# EAGLE board FI-pi Milanpreet Singh (EAGLE 8.2.1)
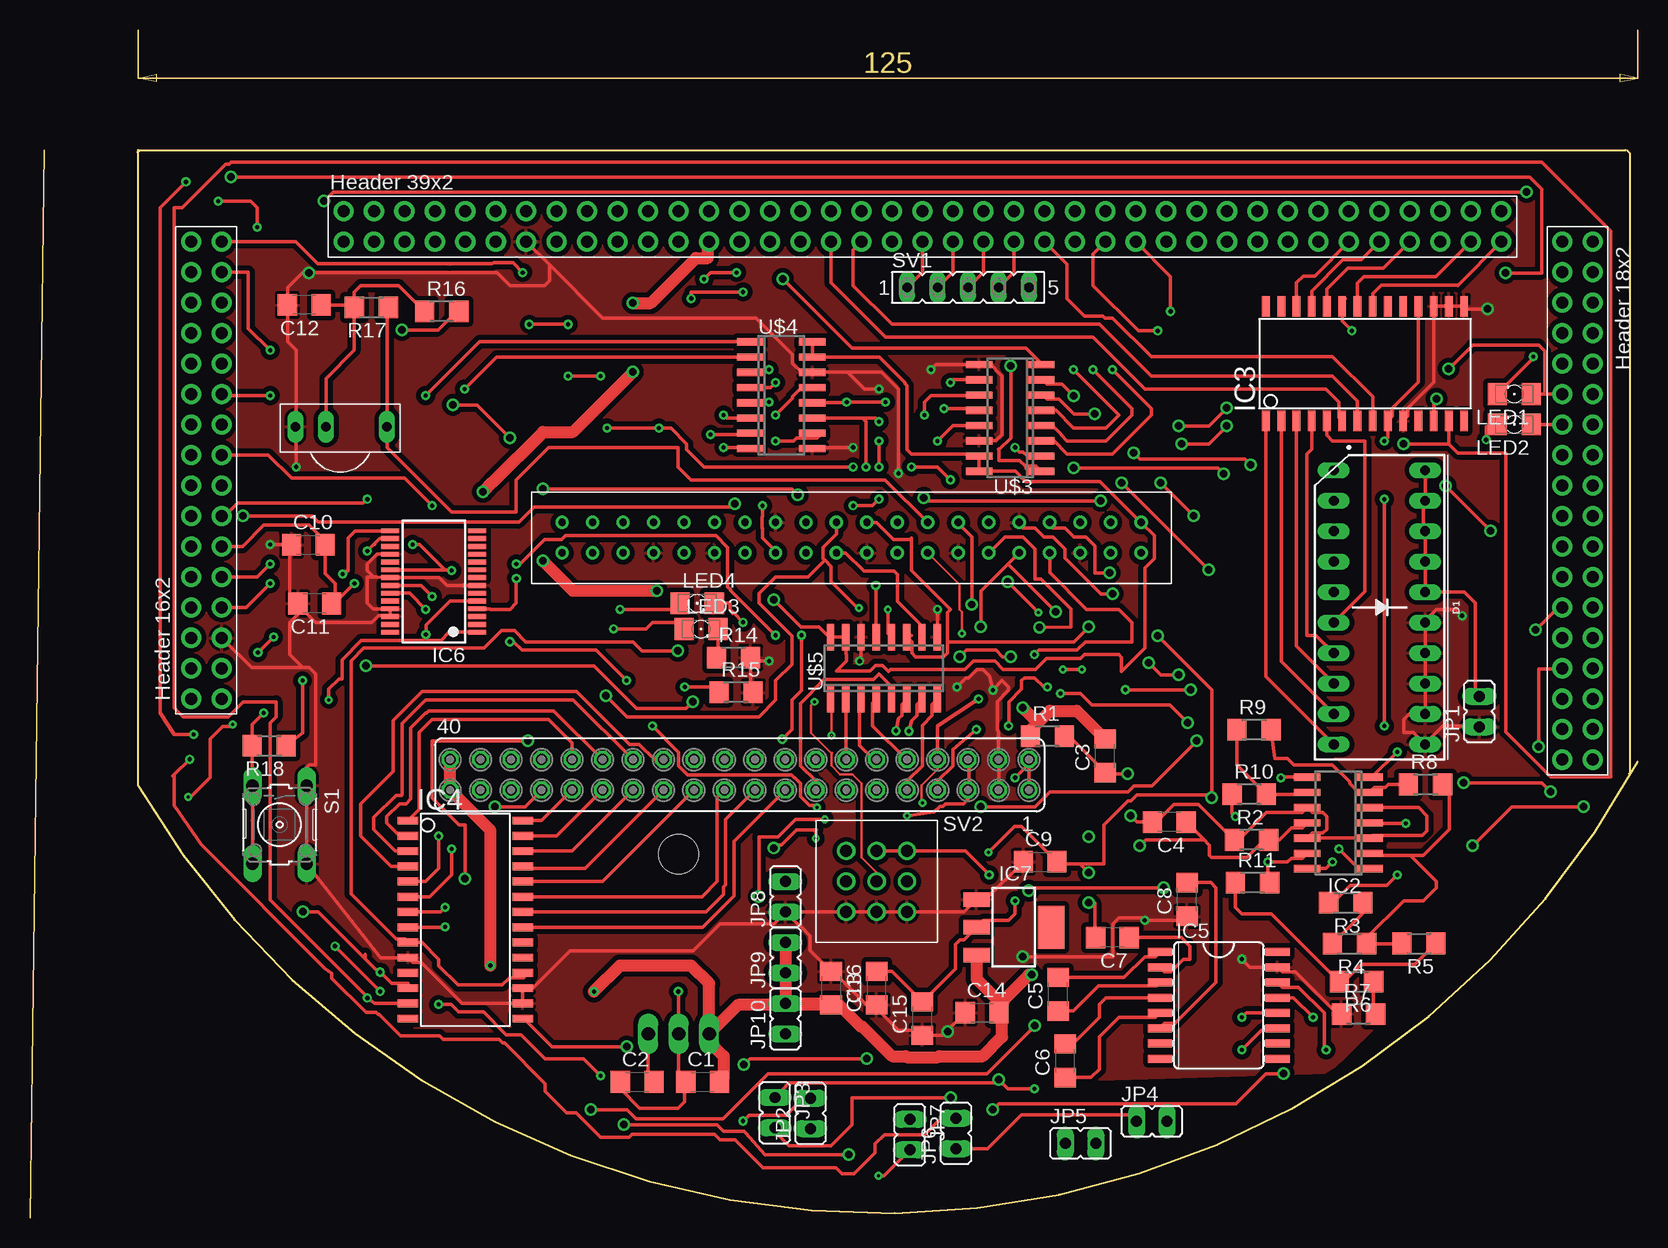
[diagram p2: board, top side]
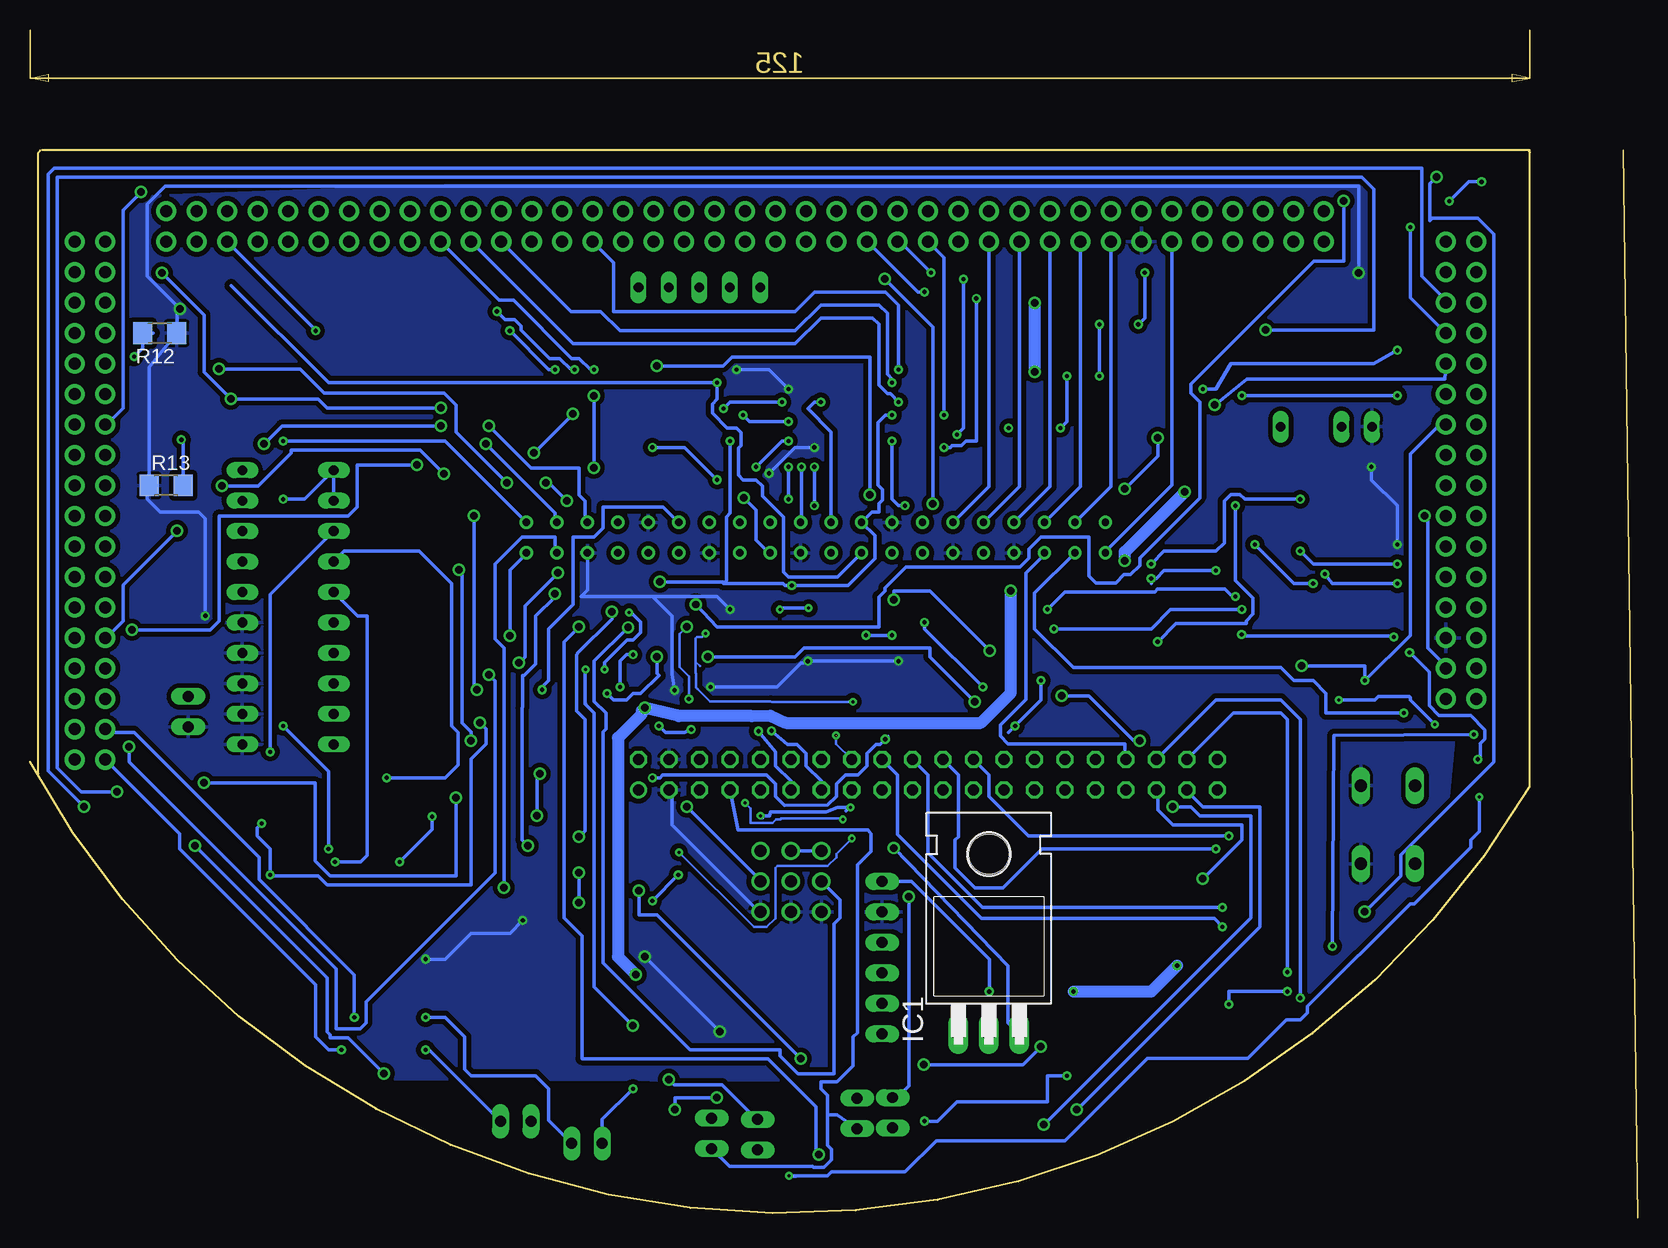
[diagram p3: board, bottom side, seen from below]

Size 125.05 x 88.63 mm. Coordinates in mm from the lower left corner, seen from the top.
Outline: 0,88.43 0.15,88.58
Outline: 124.2,88.58 124.4,88.38 124.4,36.68 124.35,36.63
Outline: 124.05,88.63 0.05,88.63 0.05,35.63 arc122 125.05,37.63
Copper layers (1*16): Top 0.035mm / dielectric 1.5mm / Bottom 0.035mm
Design rules "default": minimum track width 10mil, minimum drill 24mil, track to track 8mil, track to pad 8mil, pad to pad 8mil, via to via 8mil, smd to smd 8mil, copper to edge 40mil, drill to drill 8mil, minimum pad ring 10mil, minimum via ring 8mil, stop-mask expansion 4mil, vias tented up to drill 0mil, thermal gap 10mil
Net classes: 0 default: width 0.3 mm, clearance 0.4 mm; 1 MB29: width 1 mm, clearance 0.5 mm

## Footprints (pad centres in the part's own frame; a part is rotated, then mirrored left to right if it is on the bottom)
C1206 = smd 1.6 x 1.8: 1 -1.4,0; 2 1.4,0
LED_BARGRAPH_10 = drill 0.813 long: 1 -11.43,-3.81; 2 -8.89,-3.81; 3 -6.35,-3.81; 4 -3.81,-3.81; 5 -1.27,-3.81; 6 1.27,-3.81; 7 3.81,-3.81; 8 6.35,-3.81; 9 8.89,-3.81; 10 11.43,-3.81; 11 11.43,3.81; 12 8.89,3.81; 13 6.35,3.81; 14 3.81,3.81; 15 1.27,3.81; 16 -1.27,3.81; 17 -3.81,3.81; 18 -6.35,3.81; 19 -8.89,3.81; 20 -11.43,3.81
TO220H = drill 1.118 long: 1 -2.54,-10.16; 2 0,-10.16; 3 2.54,-10.16 | hole 3.302: 0,4.826
SO14 = smd 0.6 x 2.2: 1 -3.81,-2.6; 2 -2.54,-2.6; 3 -1.27,-2.6; 4 0,-2.6; 5 1.27,-2.6; 6 2.54,-2.6; 7 3.81,-2.6; 8 3.81,2.6; 9 2.54,2.6; 10 1.27,2.6; 11 0,2.6; 12 -1.27,2.6; 13 -2.54,2.6; 14 -3.81,2.6
SO28W = smd 0.65 x 1.7: 1 -7.62,-4.78; 2 -6.35,-4.78; 3 -5.08,-4.78; 4 -3.81,-4.78; 5 -2.54,-4.78; 6 -1.27,-4.78; 7 0,-4.78; 8 1.27,-4.78; 9 2.54,-4.78; 10 3.81,-4.78; 11 5.08,-4.78; 12 6.35,-4.78; 13 7.62,-4.78; 14 8.89,-4.78; 15 8.89,4.78; 16 7.62,4.78; 17 6.35,4.78; 18 5.08,4.78; 19 3.81,4.78; 20 2.54,4.78; 21 1.27,4.78; 22 0,4.78; 23 -1.27,4.78; 24 -2.54,4.78; 25 -3.81,4.78; 26 -5.08,4.78; 27 -6.35,4.78; 28 -7.62,4.78
SO16L = smd 0.66 x 2.032: 1 -4.445,-4.902; 2 -3.175,-4.902; 3 -1.905,-4.902; 4 -0.635,-4.902; 5 0.635,-4.902; 6 1.905,-4.902; 7 3.175,-4.902; 8 4.445,-4.902; 9 4.445,4.902; 10 3.175,4.902; 11 1.905,4.902; 12 0.635,4.902; 13 -0.635,4.902; 14 -1.905,4.902; 15 -3.175,4.902; 16 -4.445,4.902
SSOP28 = smd 0.4 x 1.5: 1 -4.225,-3.625; 2 -3.575,-3.625; 3 -2.925,-3.625; 4 -2.275,-3.625; 5 -1.625,-3.625; 6 -0.975,-3.625; 7 -0.325,-3.625; 8 0.325,-3.625; 9 0.975,-3.625; 10 1.625,-3.625; 11 2.275,-3.625; 12 2.925,-3.625; 13 3.575,-3.625; 14 4.225,-3.625; 15 4.225,3.625; 16 3.575,3.625; 17 2.925,3.625; 18 2.275,3.625; 19 1.625,3.625; 20 0.975,3.625; 21 0.325,3.625; 22 -0.325,3.625; 23 -0.975,3.625; 24 -1.625,3.625; 25 -2.275,3.625; 26 -2.925,3.625; 27 -3.575,3.625; 28 -4.225,3.625
SOT223 = smd 1.219 x 2.235: 1 -2.311,-3.099; 2 0,-3.099; 3 2.311,-3.099 | smd 3.6 x 2.2: TAB 0,3.099
JP1 = drill 0.914 long: 1 0,-1.27; 2 0,1.27
LED_1206 = smd 1.6 x 1.803: A -1.422,0; C 1.422,0
R1206 = smd 1.6 x 1.803: 1 -1.422,0; 2 1.422,0
B3F-10XX = drill 1.016 long: 1 -3.251,2.261; 2 3.251,2.261; 3 -3.251,-2.261; 4 3.251,-2.261
FE05-1 = drill 0.813 long: 1 -5.08,0; 2 -2.54,0; 3 0,0; 4 2.54,0; 5 5.08,0
FE20-2 = drill 0.914: 1 -24.13,1.27 | drill 0.914 octagon: 2 -24.13,-1.27; 3 -21.59,1.27; 4 -21.59,-1.27; 5 -19.05,1.27; 6 -19.05,-1.27; 7 -16.51,1.27; 8 -16.51,-1.27; 9 -13.97,1.27; 10 -13.97,-1.27; 11 -11.43,1.27; 12 -11.43,-1.27; 13 -8.89,1.27; 14 -8.89,-1.27; 15 -6.35,1.27; 16 -6.35,-1.27; 17 -3.81,1.27; 18 -3.81,-1.27; 19 -1.27,1.27; 20 -1.27,-1.27; 21 1.27,1.27; 22 1.27,-1.27; 23 3.81,1.27; 24 3.81,-1.27; 25 6.35,1.27; 26 6.35,-1.27; 27 8.89,1.27; 28 8.89,-1.27; 29 11.43,1.27; 30 11.43,-1.27; 31 13.97,1.27; 32 13.97,-1.27; 33 16.51,1.27; 34 16.51,-1.27; 35 19.05,1.27; 36 19.05,-1.27; 37 21.59,1.27; 38 21.59,-1.27; 39 24.13,1.27; 40 24.13,-1.27
DAUGHTERBOARD = drill 1 pad 1.676: 1 -22.86,-22.86; 1' -25.4,-22.86; 2 -22.86,-20.32; 2' -25.4,-20.32; 3 -22.86,-17.78; 3' -25.4,-17.78; 4 -22.86,-15.24; 4' -25.4,-15.24; 5 -22.86,-12.7; 5' -25.4,-12.7; 6 -22.86,-10.16; 6' -25.4,-10.16; 7 -22.86,-7.62; 7A -25.4,-7.62; 8 -22.86,-5.08; 8A -25.4,-5.08; 9 -22.86,-2.54; 9A -25.4,-2.54; 10 -22.86,0; 10A -25.4,0; 11 -22.86,2.54; 11' -25.4,2.54; 12 -22.86,5.08; 12' -25.4,5.08; 13 -22.86,7.62; 13' -25.4,7.62; 14 -22.86,10.16; 14' -25.4,10.16; 15 -22.86,12.7; 15' -25.4,12.7; 16 -22.86,15.24; 16' -25.4,15.24; 17A -12.7,17.78; 17B -12.7,15.24; 18 -10.16,15.24; 18' -10.16,17.78; 19 -7.62,15.24; 19' -7.62,17.78; 20 -5.08,15.24; 20A -5.08,17.78; 21 -2.54,15.24; 21A -2.54,17.78; 22 0,15.24; 22' 0,17.78; 23 2.54,15.24; 23' 2.54,17.78; 24 5.08,15.24; 24' 5.08,17.78; 25 7.62,15.24; 25' 7.62,17.78; 26 10.16,15.24; 26' 10.16,17.78; 27 12.7,15.24; 27' 12.7,17.78; 28 15.24,15.24; 28' 15.24,17.78; 29 17.78,15.24; 29' 17.78,17.78; 30 20.32,15.24; 30' 20.32,17.78; 31 22.86,15.24; 31' 22.86,17.78; 32 25.4,15.24; 32' 25.4,17.78; 33 27.94,15.24; 33' 27.94,17.78; 34 30.48,15.24; 34' 30.48,17.78; 35 33.02,15.24; 35A 33.02,17.78; 36 35.56,15.24; 36' 35.56,17.78; 37 38.1,15.24; 37' 38.1,17.78; 38 40.64,15.24; 38' 40.64,17.78; 39 43.18,15.24; 39' 43.18,17.78; 40 45.72,15.24; 40' 45.72,17.78; 41 48.26,15.24; 41' 48.26,17.78; 42 50.8,15.24; 42' 50.8,17.78; 43 53.34,15.24; 43' 53.34,17.78; 44 55.88,15.24; 44' 55.88,17.78; 45 58.42,15.24; 45' 58.42,17.78; 46 60.96,15.24; 46' 60.96,17.78; 47 63.5,15.24; 47' 63.5,17.78; 48 66.04,15.24; 48' 66.04,17.78; 49 68.58,15.24; 49' 68.58,17.78; 50 71.12,15.24; 50' 71.12,17.78; 51 73.66,15.24; 51' 73.66,17.78; 52 76.2,15.24; 52' 76.2,17.78; 53 78.74,15.24; 53' 78.74,17.78; 54 81.28,15.24; 54' 81.28,17.78; 55 83.82,15.24; 55' 83.82,17.78; 57 88.9,15.24; 57A 91.44,15.24; 58 88.9,12.7; 58A 91.44,12.7; 59 88.9,10.16; 59A 91.44,10.16; 60 88.9,7.62; 60A 91.44,7.62; 61 88.9,5.08; 61' 91.44,5.08; 62 88.9,2.54; 62' 91.44,2.54; 63 88.9,0; 63' 91.44,0; 64 88.9,-2.54; 64' 91.44,-2.54; 65 88.9,-5.08; 65' 91.44,-5.08; 66 88.9,-7.62; 66' 91.44,-7.62; 67 88.9,-10.16; 67' 91.44,-10.16; 68 88.9,-12.7; 68' 91.44,-12.7; 69 88.9,-15.24; 69' 91.44,-15.24; 70 88.9,-17.78; 70' 91.44,-17.78; 71 88.9,-20.32; 71' 91.44,-20.32; 72 88.9,-22.86; 72' 91.44,-22.86; 73 88.9,-25.4; 73' 91.44,-25.4; 74 88.9,-27.94; 74' 91.44,-27.94
MALE_HEADER_PACKAGE = drill 0.6: 1 -35.56,12.7; 2 -35.56,15.24; 3 -33.02,12.7; 4 -33.02,15.24; 5 -30.48,12.7; 6 -30.48,15.24; 7 -27.94,12.7; 8 -27.94,15.24; 9 -25.4,12.7; 10 -25.4,15.24; 11 -22.86,12.7; 12 -22.86,15.24; 13 -20.32,12.7; 14 -20.32,15.24; 15 -17.78,12.7; 16 -17.78,15.24; 17 -15.24,12.7; 18 -15.24,15.24; 19 -12.7,12.7; 20 -12.7,15.24; 21 -10.16,12.7; 22 -10.16,15.24; 23 -7.62,12.7; 24 -7.62,15.24; 25 -5.08,12.7; 26 -5.08,15.24; 27 -2.54,12.7; 28 -2.54,15.24; 29 0,12.7; 30 0,15.24; 31 2.54,12.7; 32 2.54,15.24; 33 5.08,12.7; 34 5.08,15.24; 35 7.62,12.7; 36 7.62,15.24; 37 10.16,12.7; 38 10.16,15.24; 39 12.7,12.7; 40 12.7,15.24
SO16 = smd 0.6 x 2.2: 1 -4.445,-2.6; 2 -3.175,-2.6; 3 -1.905,-2.6; 4 -0.635,-2.6; 5 0.635,-2.6; 6 1.905,-2.6; 7 3.175,-2.6; 8 4.445,-2.6; 9 4.445,2.6; 10 3.175,2.6; 11 1.905,2.6; 12 0.635,2.6; 13 -0.635,2.6; 14 -1.905,2.6; 15 -3.175,2.6; 16 -4.445,2.6
TSOP17XX = drill 0.813 long: GND -3.81,0; OUT 3.81,0; V+ -1.27,0
SERVO = drill 1: 1 -20.32,5.08; 1" -15.24,5.08; 1' -17.78,5.08; 2 -20.32,2.54; 2" -15.24,2.54; 2' -17.78,2.54; 3 -20.32,0; 3" -15.24,0; 3' -17.78,0

## Placement (x,y rotation side)
C1  100uf  [C1206]  47.12,10.94 0 top
C2  10uf  [C1206]  41.66,10.94 0 top
C3  .1uf  [C1206]  80.67,38.12 90 top
C4  .1uf  [C1206]  86.02,32.6 180 top
C5  .1uf  [C1206]  76.75,18.24 90 top
C6  .1uf  [C1206]  77.34,12.7 90 top
C7  .1uf  [C1206]  81.28,22.97 180 top
C8  .1uf  [C1206]  87.5,26.15 90 top
C9  .1uf  [C1206]  75.25,29.29 0 top
C10  .1uf  [C1206]  14.25,55.71 0 top
C11  100uf  [C1206]  14.79,50.82 180 top
C12  10uf  [C1206]  13.91,75.71 180 top
C13  10uf  [C1206]  57.82,18.75 270 top
C14  100uf  [C1206]  70.41,16.71 0 top
C15  10uf  [C1206]  65.44,16.21 90 top
C16  .1uf  [C1206]  61.63,18.75 90 top
D1  BLUE  [LED_BARGRAPH_10]  103.54,50.5 270 top
IC1  7805T  [TO220H]  45.12,25.1 0 bottom
IC2  LMV324M  [SO14]  100.11,32.53 90 top
IC3  MCP23017SO  [SO28W]  101.7,70.82 0 top
IC4  MCP23017SO  [SO28W]  27.34,25.1 270 top
IC5  MAX202ECWE  [SO16L]  90.14,17.32 270 top
IC6  FT232RL  [SSOP28]  24.71,52.65 90 top
IC7  LM1117IMPX-3.3  [SOT223]  73.06,23.83 270 top
JP1  [JP1]  111.86,41.8 0 top
JP2  [JP1]  56.1,8.31 0 top
JP3  [JP1]  53.15,8.36 180 top
JP4  [JP1]  84.56,7.65 270 top
JP5  [JP1]  78.62,5.81 270 top
JP6  [JP1]  68.23,6.64 0 top
JP7  [JP1]  64.39,6.54 180 top
JP8  [JP1]  54.01,26.37 0 top
JP9  [JP1]  54.01,21.29 0 top
JP10  [JP1]  54.01,16.21 0 top
LED1  [LED_1206]  114.78,68.28 180 top
LED2  [LED_1206]  114.78,65.74 180 top
LED3  [LED_1206]  46.99,48.69 0 top
LED4  [LED_1206]  46.67,50.85 0 top
R1  10k  [R1206]  75.86,39.75 0 top
R2  3.3k  [R1206]  92.88,31.11 0 top
R3  10k  [R1206]  100.72,25.88 180 top
R4  10k  [R1206]  101.04,22.45 180 top
R5  10k  [R1206]  106.82,22.48 180 top
R6  10k  [R1206]  101.62,19.29 180 top
R7  10k  [R1206]  101.8,16.6 0 top
R8  10k  [R1206]  107.38,35.73 0 top
R9  10k  [R1206]  93.08,40.29 0 top
R10  10k  [R1206]  92.68,34.91 0 top
R11  10k  [R1206]  92.96,27.54 0 top
R12  220ohm  [R1206]  114.24,73.36 180 bottom
R13  220ohm  [R1206]  113.7,60.66 0 bottom
R14  270ohm  [R1206]  49.69,46.31 0 top
R15  270ohm  [R1206]  49.91,43.42 0 top
R16  100e  [R1206]  25.37,75.17 0 top
R17  10k  [R1206]  19.51,75.52 180 top
R18  10k  [R1206]  10.99,38.97 180 top
S1  [B3F-10XX]  11.86,32.38 270 top
SV1  [FE05-1]  69.25,77.17 0 top
SV2  [FE20-2]  50.2,36.53 180 top
U$1  DAUGHTERBOARDDAUGHTERBOARD  [DAUGHTERBOARD]  29.88,65.74 0 top
U$2  MALE_HEADER  [MALE_HEADER_PACKAGE]  48.11,70.28 180 top
U$3  MCP3008SL  [SO16]  72.76,66.29 90 top
U$4  MCP3008SL  [SO16]  53.67,68.19 270 top
U$5  MCP3008SL  [SO16]  62.23,45.42 0 top
U$6  TSOP1738  [TSOP17XX]  16.99,65.55 0 top
U$7  SERVO  [SERVO]  79.41,25.1 0 top

## Tracks (layer width: path | path; a pad name or v marks a point on that pad's centre or on a via)
A
  Top 0.305: D1.20 D1.19 107.19,59.23 107.19,56.81 107.23,56.85 D1.18 D1.17 D1.16 110.61,51.77 111.51,50.87 111.51,43.42 JP1.2
ADC1
  Top 0.305: U$5.8 66.26,42.41 66.26,41.49 65.43,40.67 65.43,37.28 64.17,36.02 SV2.9
ADC2  (via drill 0.35)
  Top 0.305: U$5.7 64.99,42.41 64.99,41.49 64.53,41.04 v64.33,40.17
  Bottom 0.305: v64.33,40.17 62.89,38.44 62.89,37.28 61.63,36.02 SV2.11
ADC3  (via drill 0.35)
  Top 0.305: U$5.6 63.72,42.41 63.72,41.49 63.45,41.23 v63.25,40.21
  Bottom 0.305: v63.25,40.21 61.9,39.07 61.11,39.07 60.35,38.31 60.35,37.28 59.09,36.02 SV2.13
ADC4
  Top 0.305: U$5.5 62.87,43.9 61.83,44.93 61.37,44.48 57.26,44.48 55.29,42.51 55.29,37.28 56.55,36.02 SV2.15
ADC5
  Top 0.305: U$5.4 61.29,42.52 61.29,40.61 64.1,37.8 SV2.10
ADC6
  Top 0.305: U$5.3 60.21,42.71 60.21,38.99 61.4,37.8 SV2.12
ADC7
  Top 0.305: U$5.2 59.09,42.79 SV2.14
ADC8  (via drill 0.25)  (1 unrouted)
  Top 0.203: 57.75,42.23 57.75,42.79 U$5.1 57.85,42.76 v57.85,39.83
  Bottom 0.203: SV2.16 57.85,39.1 57.85,39.78
BAR1
  Top 0.305: IC3.5 99.16,64.84 99.63,64.37 102.33,64.37 102.33,51.83 D1.6
BAR2
  Top 0.305: IC3.4 97.89,63.71 97.47,63.29 97.47,48.17 98.25,48.17 D1.7
BAR3
  Top 0.305: D1.8 96.62,47.26 IC3.3
BAR4
  Top 0.305: IC3.2 95.35,45.99 D1.9
BAR5
  Top 0.305: IC3.1 94.08,44.72 98.69,40.12 | 98.69,40.12 D1.10 | 98.69,40.12 98.7,40.13 98.69,40.12
BUZZER  (via drill 0.61)
  Top 0.3: v81.05,53.38 79.8,53.38 79.8,55.63 79.05,56.38 78.05,56.38 77.3,57.13 76.3,57.13 76.05,57.38 U$2.7 | v84.3,45.88 85.3,44.88 v86.8,44.88 | v116.8,38.88 116.8,45.38 118.55,45.38 U$1.71
  Bottom 0.3: v81.05,53.38 83.8,50.63 83.8,46.38 v84.3,45.88 | v86.8,44.88 86.3,44.38 86.3,28.38 97.05,17.63 97.05,15.88 97.55,15.38 99.55,15.38 99.55,20.38 116.8,37.63 v116.8,38.88
CS0  (via drill 0.35)
  Top 0.305: U$3.10 68.01,69.47 v67.77,69.23
  Bottom 0.305: 108.27,77.33 100.17,69.23 v67.77,69.23 67.77,67.85 68.16,67.46 68.16,66.69 66.93,65.45 66.15,65.45 65.76,65.06 65.76,63.99 65.99,63.76 65.99,61.51 65.61,61.13 64.53,61.13 63.99,60.59 63.99,59.79 62.24,58.04 62.24,53.45 61.83,53.03 61.29,53.03 57.74,53.03 U$2.24
CS1  (via drill 0.35)
  Top 0.305: U$2.26 53.19,55.19 52.11,56.27 52.11,57.1 52.08,57.13 52.08,58.04 52.11,58.07 v52.11,58.97 | v53.19,64.37 54.71,64.37 54.94,64.6 56.66,64.6 56.97,64.91 56.38,64.91 U$4.10
  Bottom 0.305: v52.11,58.97 52.65,58.97 53.19,59.51 v53.19,64.37
CS2
  Top 0.305: U$2.22 59.04,55.04 60.55,53.53 63.05,53.53 63.35,53.23 63.35,50.99 65.24,49.1 65.24,48.19 U$5.10
D4
  Bottom 0.305: U$1.26 40.04,60.57 U$2.33
D5
  Bottom 0.305: U$1.25 37.5,60.57 U$2.35
D6
  Bottom 0.305: U$1.27 42.58,60.57 U$2.31
D7
  Bottom 0.305: U$1.28 45.12,60.57 U$2.29
EL  (via drill 0.35, 0.61)
  Top 0.3: 83.97,43.63 v87.8,43.63 | v85.3,60.88 v88.05,58.13 | v109.3,70.38 111.3,72.38 116.8,72.38 117.3,71.88 117.3,68.28
  Top 0.305: U$1.62 117.3,68.28 LED1.A | 83.97,43.63 v82.35,43.63
  Bottom 0.3: 79.8,51.63 79.8,56.38 78.05,56.38 77.3,57.13 77.3,58.88 72.3,58.88 71.05,57.63 U$2.11 | v87.8,43.63 88.05,43.88 v88.05,58.13 | v85.3,60.88 89.55,65.13 89.55,67.38 90.55,68.38 100.55,68.38 102.55,70.38 v109.3,70.38
  Bottom 0.305: 79.8,51.63 79.8,50.72 81.81,48.71 81.81,44.39 82.35,43.85 v82.35,43.63
EN
  Bottom 0.305: U$1.24 34.96,60.57 U$2.37
ER  (via drill 0.61)
  Top 0.203: 69.55,51.73 69.55,51.83
  Top 0.3: v69.55,50.73 69.55,51.73 | 69.55,51.83 69.55,56.38 68.55,57.38 U$2.13 | v15.55,84.38 16.3,85.13 v115.8,85.13
  Top 0.305: U$1.63 LED2.A
  Bottom 0.3: v69.55,50.73 67.8,48.88 54.3,48.88 54.3,51.38 53.8,51.88 53.8,52.13 52.05,53.88 42.55,53.88 41.8,54.63 41.8,55.38 40.8,56.38 36.8,56.38 36.8,53.13 | 32.55,54.63 27.55,59.63 27.55,67.63 28.3,68.38 28.3,69.13 18.05,79.38 15.55,79.38 v15.55,84.38 | v115.8,85.13 117.3,83.63 117.3,67.13 118.55,65.88 U$1.63
  Bottom 0.305: 36.8,53.13 36.2,52.53 34.55,52.53 33.86,53.22 33.32,53.22 32.55,53.99 32.55,54.63
GND  (via drill 0.35, 0.61)
  Top 0.3: SV2.3 71.8,35.38 71.8,37.63 SV2.4 | v73.8,21.38 81.3,21.38 81.3,24.13 81.8,24.63 83.8,24.63 v83.97,24.41 | v67.55,15.13 67.49,15.19 | v112.55,75.38 110.8,75.38 IC3.15 | v14.3,78.38 14.3,78.41 | JP8.1 53.8,24.88 53.05,24.13 48.55,24.13 46.3,21.88 36.05,21.88 33.05,18.88 32.3,18.88 IC4.17
  Top 0.305: IC3.15 IC3.16 IC3.17 108.05,69.27 105.9,67.12 105.9,66.44 IC3.10 | JP1.1 111.78,40.61 108.81,40.61 107.35,39.15 D1.11 106.35,40.07 105.57,40.07 105.57,41.15 106.11,41.69 107.19,41.69 107.27,41.61 D1.12 D1.13 D1.14 D1.15 107.35,49.41 108.27,50.33 109.89,50.33 v110.43,49.79 | R7.1 100.03,16.6 96.53,20.11 95.43,20.11 IC5.15 92.75,20.5 v92.07,21.17 | v83.97,24.41 87.16,24.41 C8.1 | U$1.3 9.51,45.47 13.77,45.47 | 13.77,45.47 14.31,45.47 14.85,44.93 14.85,37.37 14.31,37.37 13.82,36.88 S1.1 S1.2 20.26,21.29 IC4.10 22.95,20.9 23.64,20.9 27.06,17.48 IC4.16 IC4.17 | C9.1 70.7,26.14 IC7.1 68.92,25.1 U$7.3" U$7.3' U$7.3 JP8.1 55.19,23.93 55.29,23.93 56.09,23.13 56.09,21.89 C13.1 57.99,20.15 60.75,17.39 61.59,17.39 C16.1 61.63,17.05 63.45,15.23 65.02,15.23 C15.1 67.11,14.81 67.49,15.19 C14.1 | C11.2 13.39,49.95 12.69,49.25 12.69,46.55 13.77,45.47 | C10.1 12.71,55.71 12.69,55.73 | 12.69,55.73 12.69,51.52 C11.2 | 21.09,49.83 IC6.25 19.67,50.38 19.17,50.87 19.17,53.03 19.71,53.03 | 21.09,49.83 IC6.26 | C11.2 13.39,50.71 14.85,49.25 19.53,49.25 20.11,49.83 21.09,49.83 | 19.71,53.03 19.95,53.03 IC6.21 25.17,52.98 25.81,52.33 IC6.7 | 19.71,53.03 19.17,53.57 19.17,54.11 19.99,54.93 IC6.18 | 13.23,64.52 U$6.GND 13.23,65.6 | 12.69,55.73 v11.07,55.73 | R15.2 51.11,43.64 R14.2 51.41,46.01 v52.65,46.01 | 34.35,79.05 U$1.23 | 34.35,79.05 38.77,74.63 51.57,74.63 54.62,71.59 54.62,70.84 55.36,70.1 U$4.14 59.2,70.1 | 59.2,70.1 62.05,70.1 63.45,68.69 v63.45,61.67 | v59.67,63.83 56.36,63.83 U$4.9 | U$3.14 71.56,64.39 72.09,64.91 72.09,69.77 71.01,70.85 70.28,70.85 U$3.9 66.58,70.74 v66.15,70.31
  Top 0.305: U$5.9 66.69,48.04 v66.69,50.33 | U$5.14 60.33,46.13 v60.21,46.01 | 13.23,65.6 13.23,71.93 12.51,72.65 C12.2 12.51,77.15 13.77,78.41 14.3,78.41 29.97,78.41 31.05,77.33 33.95,77.33 34.35,77.73 34.35,79.05 | 13.23,65.6 v13.23,62.21 | 71.79,38.58 SV2.4 71.79,40.14 71.7,40.23 71.7,42.67 72.63,43.6 72.63,43.85 72.09,44.39 v71.31,43.59 71.01,44.77 70.47,45.31 69.97,45.31 69.28,44.62 69.08,44.62 v68.31,43.85 | 59.2,70.1 60.61,68.69 v61.83,68.69
  Bottom 0.3: SV2.3 71.55,35.13 71.55,32.38 64.3,25.13 U$7.3" | 68.55,43.88 67.77,43.88 62.8,43.88 60.8,45.88 60.3,45.88 v60.21,46.01 | v67.55,15.13 v73.8,21.38 | R12.1 112.8,73.38 112.8,75.13 v112.55,75.38 115.3,78.13 115.3,84.13 113.8,85.63 14.3,85.63 v14.3,78.38
  Bottom 0.305: R12.1 115.12,70.52 R13.1 115.29,60.5 115.29,59.51 114.21,58.43 110.97,58.43 110.43,57.89 v110.43,49.79 | v92.07,21.17 90.45,21.17 88.29,23.33 85.05,23.33 v83.97,24.41 | v11.07,55.73 11.07,58.97 13.23,61.13 v13.23,62.21 | v63.45,61.67 61.29,63.83 v59.67,63.83 | v66.15,70.31 63.45,70.31 v61.83,68.69 | v66.69,50.33 67.77,51.41 73.17,51.41 | 73.17,51.41 79.11,51.41 78.59,51.93 U$2.6 | 73.17,51.41 71.55,49.79 71.55,44.93 v71.31,43.59 | 67.77,43.88 67.8,43.85 v68.31,43.85 | v52.65,46.01 v60.21,46.01
  pour Top: 1.4,35.58 29.4,9.58 99.3,11.68 122.5,34.33 124.1,86.93 123.25,88.28 1.45,88.63
  pour Bottom: 1.85,87.08 7.55,27.23 10.35,21.98 13.25,20.48 30.05,10.93 95.05,11.18 104.15,15.73 109.9,23.78 116.5,25.88 121.9,34.83 124.2,37.88 120.4,88.23 120.3,84.58 10.35,88.58
GND1  (via drill 0.61)
  Top 0.3: 73.55,57.38 73.8,57.13 74.8,57.13 75.55,56.38 76.3,56.38 77.3,55.38 77.3,54.63 80.3,51.63 v81.3,51.63 | v83.55,30.63 84.05,31.13 88.8,31.13 88.84,31.18
  Top 0.305: IC2.11 97.09,32.12 96.18,32.12 95.18,31.11 R2.2 93.94,31.11 92.49,29.66 89.52,29.66 89.37,29.81 89.37,30.65 88.84,31.18 C4.1
  Bottom 0.3: 84.05,42.13 84.05,31.13 v83.55,30.63
  Bottom 0.305: v81.3,51.63 81.3,51.38 82.89,49.79 82.89,45.79 83.86,44.82 83.97,44.82 83.97,42.21 84.05,42.13
GPA0
  Top 0.305: SV2.17 49.74,30.99 49.74,26.45 47.13,23.83 IC4.21
GPA1
  Top 0.305: IC4.22 47.4,25.1 48.87,26.57 48.87,27.2 49.04,27.36 49.04,32.83 SV2.19
GPA2
  Top 0.305: IC4.23 47.05,26.37 48.33,27.65 48.33,34.66 SV2.21
GPA3
  Top 0.305: IC4.24 38.77,27.64 SV2.23
GPA4
  Top 0.305: IC4.25 32.12,28.74 32.13,28.73 37.32,28.73 SV2.25
GPA5
  Top 0.305: IC4.26 36.23,30.18 SV2.27
GPA6
  Top 0.305: IC4.27 34.96,31.45 SV2.29
GPA7
  Top 0.305: IC4.28 33.69,32.72 SV2.31
GPB0
  Top 0.305: IC4.1 23.49,33.65 23.49,40.07 24.57,41.15 34.29,41.15 36.23,39.21 SV2.32
GPB1
  Top 0.305: IC4.2 21.85,31.45 20.79,32.51 20.79,33.05 21.87,34.13 22.41,34.13 22.79,34.51 22.79,40.45 24.03,41.69 24.11,41.69 24.28,41.86 34.72,41.86 SV2.30
GPB2
  Top 0.305: IC4.3 21.5,30.18 19.71,31.97 19.71,32.97 21.58,34.84 22.04,34.84 22.08,34.88 22.08,40.82 24.03,42.77 36.34,42.77 SV2.28
GPB3
  Top 0.305: IC4.4 21.15,28.91 18.63,31.43 18.63,34.13 21.33,36.83 21.33,41.07 23.74,43.48 36.63,43.48 41.04,39.07 41.83,39.07 43.1,37.8 SV2.26
GPB4  (via drill 0.35)
  Top 0.305: IC4.5 24.02,27.64 25.11,28.73 v25.11,31.43
  Bottom 0.305: SV2.24 45.11,36.53 45.11,34.74 41.81,31.43 v25.11,31.43
GPB5  (via drill 0.35)
  Top 0.305: IC4.6 24.37,26.37 26.19,28.19 v26.19,30.35
  Bottom 0.305: SV2.22 47.65,36.53 47.65,31.38 47.94,31.1 47.94,28.76 46.29,27.11 43.95,27.11 40.71,30.35 v26.19,30.35
GPB6  (via drill 0.35)
  Top 0.305: IC4.7 25.26,25.1 v25.65,25.49
  Bottom 0.305: SV2.20 50.19,36.53 50.19,30.02 45.67,25.49 v25.65,25.49
GPB7  (via drill 0.35)
  Top 0.305: IC4.8 25.61,23.83 v25.65,23.87
  Bottom 0.305: SV2.18 52.73,36.53 52.73,31.56 45.73,24.56 26.34,24.56 v25.65,23.87
GPIO16
  Bottom 0.3: 42.05,44.93 42.05,53.38 40.55,54.88 U$2.36 | 36.55,39.13 35.91,39.13 33.8,39.13 33.8,37.88 SV2.34
  Bottom 0.305: 35.91,39.13 43.53,39.13 44.18,39.78 44.18,40.68 42.05,42.81 42.05,44.93 42.05,44.63
INTSWITCH  (via drill 0.35)
  Top 0.305: 9.57,35.21 R18.2 9.57,40.73 v10.53,41.69 | 9.57,35.21 9.57,34.5 S1.3 9.6,32.73 | 9.45,35.1 9.57,35.21 | 9.6,32.73 S1.4 | 9.6,32.73 9.55,32.73 9.6,32.73
  Bottom 0.305: v10.53,41.69 17.01,41.69 17.01,43.31 18.09,44.39 19.71,44.39 20.79,45.47 38.07,45.47 41.31,48.71 41.31,51.68 U$2.38
IR1  (via drill 0.61)
  Top 0.3: 74.05,62.13 75.05,62.13 75.3,61.88 U$3.1 | v55.05,59.88 54.55,60.38 v33.8,60.38 | v31.05,64.63 28.3,67.38 v26.3,67.38
  Top 0.305: v72.8,70.63 72.8,64.63 71.86,63.68 71.78,63.68 71.81,63.65 71.81,62.75 73.54,62.75 74.03,62.27 74.92,62.27 75.05,62.13
  Bottom 0.3: v72.8,70.63 67.3,70.63 66.55,71.38 55.05,71.38 v55.05,59.88 | v33.8,60.38 31.05,63.13 v31.05,64.63 | v26.3,67.38 23.6,69.53 7.1,69.53 7.05,70.63 U$1.12
IR2  (via drill 0.35)
  Top 0.305: U$3.2 74.18,63.12 73.84,63.46 73.55,63.46 v73.17,63.83 | U$1.16 13.2,80.98 15.04,79.14 26,79.14 | 26.03,79.12 26,79.14 | v32.67,74.09 v35.91,74.09 | v35.91,69.77 v38.61,69.77 | v39.15,65.45 v43.47,65.45 44.47,65.45 45.8,64.13 45.8,63.67 47.25,62.21 v59.67,62.21 | v59.67,58.97 61.29,58.97 v61.83,59.51 | v64.53,62.21 66.69,62.21 v67.77,61.13 | v61.83,62.21 v61.83,64.37 | 26,79.14 29.58,79.14 29.68,79.24 31.31,79.24 v32.13,78.41
  Bottom 0.305: v73.17,63.83 70.47,63.83 v67.77,61.13 | v32.13,78.41 32.13,74.63 v32.67,74.09 | v38.61,69.77 38.61,65.99 v39.15,65.45 | v59.67,62.21 v59.67,58.97 | v61.83,59.51 v61.83,62.21 | v61.83,64.37 62.37,64.37 v64.53,62.21 | 36.04,74.09 v35.91,74.09 35.91,70.73 v35.91,69.77
IR3  (via drill 0.35)
  Top 0.305: U$3.3 76.4,64.39 77.49,63.29 81.27,63.29 84.51,66.53 84.51,67.07 v81.27,70.31 | v85.05,73.55 83.43,73.55 79.65,77.33 79.65,79.95 U$1.42
  Bottom 0.305: v81.27,70.31 81.81,70.31 v85.05,73.55
IR4  (via drill 0.35)
  Top 0.305: U$3.4 76.27,65.66 77.01,64.92 77.01,64.85 77.49,64.37 80.73,64.37 81.98,65.62 | 81.98,65.62 | 81.98,65.62 82.89,66.53 82.89,67.07 v79.65,70.31 | v86.13,75.17 86.13,78.07 U$1.43
  Bottom 0.305: v79.65,70.31 79.95,70.31 80.89,71.24 81.74,71.24 84.12,73.62 84.12,73.94 84.67,74.48 85.44,74.48 v86.13,75.17
IR5  (via drill 0.35)
  Top 0.305: U$3.5 76.56,66.93 78.03,65.45 80.73,65.45 81.81,66.53 v78.03,70.31
  Bottom 0.305: U$1.46 85.96,76.1 84.75,76.1 79.89,71.24 79.27,71.24 78.33,70.31 v78.03,70.31
IR6  (via drill 0.61)
  Top 0.3: v79.8,66.63 78.05,66.63 76.8,67.88 75.8,67.88 75.55,68.13 U$3.6 | v83.05,63.38 83.55,62.88 92.3,62.88 v92.8,62.38 | v116.55,48.63 118.3,50.38 118.55,50.38 U$1.69
  Bottom 0.3: v83.05,63.38 v79.8,66.63 | v92.8,62.38 97.8,62.38 97.8,58.88 98.55,58.13 109.3,58.13 109.3,49.38 110.05,48.63 v116.55,48.63
IR7  (via drill 0.61)
  Top 0.3: v78.05,68.13 77.05,69.13 75.8,69.13 75.55,69.38 U$3.7 | v78.05,62.13 90.05,62.13 v90.55,61.63 | v112.8,56.88 v109.05,60.63
  Bottom 0.3: v78.05,62.13 v78.05,68.13 | v90.55,61.63 92.55,63.63 103.3,63.63 103.3,63.38 106.05,60.63 v109.05,60.63 | v112.8,56.88 117.3,52.38 117.3,49.38 118.55,48.13 U$1.70
IR8  (via drill 0.61)
  Top 0.3: v53.8,77.88 59.55,72.13 74.05,72.13 75.3,70.88 U$3.8 | v49.8,59.13 49.55,58.88 33.05,58.88 31.8,57.63 15.05,57.63 14.55,58.13 v8.8,58.13
  Bottom 0.3: v53.8,77.88 49.8,73.88 v49.8,59.13 | v8.8,58.13 8.55,57.88 8.55,47.13 7.05,45.63 U$1.2
L1
  Top 0.305: IC3.25 97.89,76.87 100.5,79.48 102.04,79.48 U$1.51
L2
  Top 0.305: IC3.24 99.16,77.04 100.9,78.78 103.88,78.78 U$1.52
MB4  (via drill 0.35)
  Top 0.305: U$1.4 9.08,50.5 v11.07,52.49 | v17.11,53.28 17.55,53.57 17.55,56.27 18.16,56.88 IC6.15
  Bottom 0.305: v11.07,52.49 16.47,52.49 v17.11,53.28
MB5  (via drill 0.35)
  Top 0.305: U$1.5 10,53.04 v11.07,54.11 | 19.71,55.73 v19.17,55.19 | 19.71,55.73 19.78,55.73 | IC6.16 20.21,56.23 19.71,55.73
  Bottom 0.305: v19.17,55.19 18.09,54.11 v11.07,54.11
MB6  (via drill 0.35)
  Top 0.305: U$1.6 8.76,55.58 10.53,57.35 14.31,57.35 15.39,56.27 15.39,55.97 C10.2 15.65,53.31 16.47,52.49 16.47,51.1 C11.1 16.42,50.82 v18.09,52.49 | 25.65,53.63 26.14,53.63 v26.19,53.57 | 25.65,53.63 IC6.20 | v31.59,52.91 31.59,50.87 31.05,50.33 29.46,50.33 29.42,50.38 IC6.4 | v22.95,55.73 23.55,55.73 25.65,53.63
  Bottom 0.305: v26.19,53.57 30.51,53.57 31.17,52.91 v31.59,52.91 31.59,52.49 | v18.09,52.49 19.71,52.49 v22.95,55.73
MB7  (via drill 0.35)
  Top 0.3: SV2.1 74.3,35.38 74.3,37.63 SV2.2
  Top 0.305: SV2.2 74.33,37.45 v73.17,36.29 | v53.19,48.17 49.44,51.92 49.44,51.98 49.22,52.21 49.22,55.5 48.24,56.48 35.71,56.48 35.38,56.15 33.93,56.15 31.89,54.11 v31.59,54.11 | v55.35,48.17 55.35,43.57 54.58,42.8 54.58,40.33 v53.76,39.51 | U$1.7 7.29,58.12 8.36,59.19 9.24,59.19 9.25,59.18 18.84,59.18 v19.17,59.51
  Bottom 0.305: v19.17,59.51 23.79,59.51 24.19,59.9 24.96,59.9 25.5,59.36 25.5,55.88 26.19,55.19 30.51,55.19 v31.59,54.11 | v73.17,36.29 72.55,36.29 72.31,36.53 63.65,36.53 62.89,35.77 62.89,34.74 62.15,34 58.57,34.05 57.83,34.74 57.83,35.77 57.06,36.54 56.03,36.54 55.27,37.29 55.27,38.33 54.53,39.07 54.2,39.07 v53.76,39.51 53.53,39.73 | v53.19,48.17 v55.35,48.17
MB9  (via drill 0.25, 0.35)
  Top 0.3: SV2.5 69.3,35.38 69.3,37.63 SV2.6
  Top 0.305: 7.38,63.2 U$1.9 10.92,63.2 12.84,61.28 22.26,61.28 v24.57,58.97 | SV2.5 69.25,34.53 68.85,34.13 67.37,34.13 67.15,33.91 66.89,33.91 66.41,33.43 v64.15,33.13 | v42.93,40.61 45.13,38.42 45.13,37.28 45.87,36.54 54.52,36.54 54.77,36.29 54.81,36.29 55.29,35.82 55.29,34.74 56.03,34 56.68,34 v56.65,33.83 | v31.05,47.63 31.37,47.63 32.07,46.93 38.24,46.93 v40.77,44.39
  Bottom 0.305: v24.57,58.97 24.57,52.73 23.1,51.26 23.1,49.95 23.67,49.38 23.67,49.16 29.52,49.16 v31.05,47.63 | v40.77,44.39 40.77,42.77 v42.93,40.61 43.47,40.07 | 57.05,33.53 v56.65,33.83 57.74,33.83 58.71,33.46 63.33,33.46 63.41,33.13 v64.15,33.13 63.98,32.96
MB10  (via drill 0.35, 0.61)
  Top 0.3: v87.55,40.88 86.05,42.38 79.55,42.38 | v46.3,42.63 46.05,42.88 | 40.8,42.88 38.05,45.63 v19.05,45.63
  Top 0.305: R3.2 99.66,25.88 101.11,27.34 104.17,27.34 v105.03,28.19 | R18.1 13.77,40.03 v13.77,44.39 | 79.55,42.38 78.62,43.31 v76.95,43.31 | 40.8,42.88 41.6,42.09 45.75,42.09 v46.3,42.63 | v68.55,46.38 69.1,46.93 71.55,46.93 72.1,46.38 v72.8,46.38 | v105.75,32.48 102.76,32.48 IC2.4
  Bottom 0.3: v87.55,40.88 87.05,40.38 87.05,39.13 88.3,37.88 88.3,27.38 100.3,27.38 101.05,28.13 104.8,28.13 v105.03,28.19 | v68.55,46.38 61.3,46.38 60.55,47.13 50.05,47.13 50.05,46.38 v46.3,42.63 | v19.05,45.63 13.8,45.63 13.8,44.63 v13.77,44.39
  Bottom 0.305: v105.03,28.19 105.03,30.35 106.11,31.43 106.11,32.12 v105.75,32.48 | U$1.10 7.54,65.74 9.99,63.29 9.99,48.17 v13.77,44.39 | v72.8,46.38 72.8,45 72.63,44.83 74.15,43.31 74.79,43.31 75.33,42.77 76.41,42.77 v76.95,43.31
MB29  (via drill 0.35, 0.61)
  Top 1: 75.05,40.88 74.55,40.38 74.55,39.88 R1.1 | 75.05,40.88 76.05,41.88 78.3,41.88 80.55,39.63 C3.2 | v41.3,75.88 42.8,75.88 46.55,79.63 47.55,79.63 47.55,80.88 U$1.29 | v41.3,70.13 36.3,65.13 33.8,65.13 29.6,60.93 v28.8,60.13 | v33.8,54.38 36.3,51.88 v43.3,51.88 | v73.8,42.13 75.05,40.88 | v74.55,19.88 74.3,19.88 72.3,17.88 72.09,17.39
  Top 1.016: SV2.40 SV2.39 29.43,31.9 v29.43,20.63 | JP9.2 JP9.1 JP10.2 57.69,17.48 C13.2 | C13.2 50.07,17.35 IC1.1 | IC1.1 47.66,14.28 48.87,13.07 48.87,11.29 C1.2 | IC1.1 47.66,19.14 46.17,20.63 40.23,20.63 v38.07,18.47 | IC7.3 69.96,19.52 72.09,17.39 72.09,16.99 C14.2 72.09,16.43 72.09,14.69 70.47,13.07 66.83,13.07 66.76,13.01 64.12,13.01 64.05,13.07 62.91,13.07 60.44,15.55 60.31,15.55 58.5,17.35 C13.2
  Bottom 1: v41.3,70.13 v41.3,75.88 | v28.8,60.13 33.8,55.13 v33.8,54.38 | v43.3,51.88 43.3,43.38 45.8,40.88 62.05,40.88 63.35,41.48 64.9,41.43 70.95,41.43 | v74.55,19.88 76.05,21.38 76.05,39.63 74.05,41.63 74.05,41.88
  Bottom 1.016: v38.07,18.47 31.59,18.47 v29.43,20.63 | 70.95,41.43 v73.8,42.13 74.05,41.88
MB33
  Top 0.305: IC3.6 100.17,66.3 100.17,67.61 99.09,68.69 83.97,68.69 79.65,73.01 62.37,73.01 57.82,77.56 U$1.33
MB34
  Top 0.305: IC3.7 101.7,67.7 99.63,69.77 84.51,69.77 80.19,74.09 62.91,74.09 59.67,77.33 59.67,80.29 U$1.34
MB40
  Top 0.305: IC3.8 102.97,68.05 99.63,71.39 84.51,71.39 81.27,74.63 80.65,74.63 80.48,74.8 78.95,74.8 77.49,76.25 77.49,79.09 U$1.40
MISO  (via drill 0.25, 0.35, 0.61)
  Top 0.3: v27.3,27.88 27.3,32.38 26.8,32.38 24.55,34.63 24.55,39.38 v32.55,39.38 | 39.55,42.63 v39.05,43.13 | 41.3,41.38 51.8,41.38 | 51.8,50.88 54.55,48.13 | 57.8,53.88 57.83,53.92
  Top 0.305: U$4.12 59.08,67.56 v59.13,67.61 v62.37,67.61 | v67.23,67.07 70.02,67.07 U$3.12 | U$2.21 58.27,56.61 57.16,55.5 57.16,54.59 57.3,54.45 | 57.3,54.45 57.83,53.92 57.83,52.65 60.15,50.33 v60.15,50.43 | 41.27,41.38 41.3,41.38 40.8,41.38 v39.05,43.13 | 51.8,50.88 51.8,51.64 53.19,53.03 55.89,53.03 57.3,54.45 | 51.8,41.38 53.19,42.77 53.19,44.39 54.55,45.75 54.55,48.13 | v62.55,50.33 62.55,48.34 U$5.12
  Bottom 0.3: v27.3,27.88 24.05,31.13 24.05,32.38 29.8,32.38 31.05,33.63 31.05,35.13 SV2.35 | v32.55,39.38 33.05,39.38 36.8,43.13 v39.05,43.13
  Bottom 0.305: v59.13,67.61 59.67,67.61 60.21,67.07 58.27,65.13 U$2.21 | v62.37,67.61 66.69,67.61 v67.23,67.07 | v60.15,50.43 62.45,50.43 v62.55,50.33
MOSI  (via drill 0.35, 0.61)
  Top 0.3: v29.8,33.88 32.3,33.88 33.55,35.13 SV2.33 | 50.7,6.68 52.3,4.88 v59.3,4.88 | v79.3,48.88 78.05,47.63 67.53,47.63
  Top 0.305: U$4.11 60.46,66.29 | 60.46,66.29 60.75,65.99 v60.75,62.21 | 60.46,66.29 61.54,66.29 v61.83,65.99 | v65.61,66.53 65.61,67.61 66.15,68.15 70.12,68.15 U$3.11 | U$2.19 61.6,57.58 63.03,56.15 64.41,56.15 64.53,56.27 64.53,53.57 67.77,50.33 67.53,50.09 67.53,47.63 67.53,46.69 67.2,46.37 64.88,46.37 64.55,46.69 64.55,47.61 U$5.11 64.38,48.02 64.53,48.17 | 50.7,6.68 50.55,6.83 48.85,6.83 48.3,7.38 v40.55,7.38
  Bottom 0.3: v29.8,33.88 28.3,33.88 27.55,33.13 23.3,33.13 23.3,24.63 v40.55,7.38 | v59.3,4.88 59.55,5.13 59.55,8.88 63.55,12.88 79.05,12.88 79.05,23.13 80.55,24.63 80.55,42.63
  Bottom 0.305: v60.75,62.21 60.75,57.64 U$2.19 | v61.83,65.99 65.07,65.99 v65.61,66.53 | 80.55,42.63 80.55,47.63 v79.3,48.88
N$1  (via drill 0.35)
  Top 0.305: C2.1 40.26,10.34 41.85,8.75 45.09,8.75 45.63,9.29 45.63,10.85 C1.1 45.12,11.54 IC1.2 45.12,18.44 v45.09,18.47
  Bottom 0.305: v45.09,18.47 45.09,21.17 51.57,27.65 JP8.2
N$2
  Top 0.305: R11.1 91.54,25.49 92.07,24.95 94.54,24.95 R6.2 100.56,19.29 102.01,20.75 106.51,20.75 R5.1
N$3  (via drill 0.61)
  Top 0.3: R1.2 77.3,39.63 77.8,39.63 80.55,36.88 C3.1 80.8,36.63 v82.55,36.63 | v82.8,33.13 83.3,32.63 84.55,32.63 C4.2
  Top 0.305: C4.2 84.94,32.6 86.39,34.06 88.45,34.06 91.39,31.11 R2.1 91.82,31.11 94.09,33.39 97.09,33.39 IC2.10 97.93,33.39 98.84,33.39 99.16,33.06 99.16,32 98.84,31.68 97.93,31.68 IC2.12 99.76,31.26 99.79,31.28 100.56,31.28 100.58,31.26 IC2.3 102.93,31.48 107.1,31.48 107.5,31.88 107.5,33.13 106.83,33.8 IC2.5
  Bottom 0.3: v82.55,36.63 82.8,36.38 v82.8,33.13
N$4
  Top 0.305: R3.1 102.14,24.98 R4.2
N$5
  Top 0.305: R5.2 105.37,22.45 R4.1 102.46,22.93 105.57,26.03 107.19,26.03 108.27,27.11 108.27,27.65 106.11,29.81 | 106.11,29.81 102.89,29.81 IC2.2 | 106.11,29.81 107.19,29.81 109.35,31.97 109.35,35.19 R8.2
N$6
  Top 0.305: R8.1 104.28,35.73 104.04,35.49 103.13,35.49 IC2.6 101.8,35.07 101.06,35.81 101.06,35.95 99.63,37.37 96.39,37.37 95.85,37.91 94.83,37.91 R9.2
N$7
  Top 0.305: R6.1 103.04,16.78 R7.2
N$8
  Top 0.305: IC2.9 97.35,34.91 R10.2 91.66,37.36 R9.1
N$9  (via drill 0.35)
  Top 0.305: R10.1 91.26,33.33 v91.53,33.05 | R11.2 94.23,27.7 v94.23,29.27 95.88,29.27 96.18,29.58 97.09,29.58 IC2.13
  Bottom 0.305: v91.53,33.05 91.53,31.97 v94.23,29.27
N$10  (via drill 0.35)
  Top 0.305: v100.17,30.35 101.06,29.47 101.06,29.46 101.8,28.72 IC2.1 | v103.95,40.61 v103.95,59.51
  Bottom 0.305: v100.17,30.35 100.17,36.83 v103.95,40.61 | v103.95,59.51 102.15,59.51 D1.1 D1.2
N$11
  Top 0.305: C5.1 78.02,16.84 80.12,18.94 84.95,18.94 IC5.3
N$12  (via drill 0.35)
  Top 0.305: IC2.8 95.36,36.34 v95.31,36.29
  Bottom 0.305: v95.31,36.29 90.45,36.29 89.37,37.37 89.37,40.07 89.91,40.61 89.91,52.49 92.61,55.19 98.85,55.19 D1.4
N$13  (via drill 0.35)
  Top 0.305: IC2.14 99.08,28.72 v99.63,29.27
  Bottom 0.305: v99.63,29.27 97.47,29.27 96.93,29.81 96.93,49.79 97.75,49.79 D1.5
N$14  (via drill 0.35)
  Top 0.305: v116.37,71.39 116.37,71.3 LED1.C
  Bottom 0.305: 114.76,73.36 R12.2 115.66,72.1 v116.37,71.39
N$15  (via drill 0.35)
  Top 0.305: v112.43,64.47 112.43,65.59 LED2.C
  Bottom 0.305: R13.2 112.28,64.32 v112.43,64.47
N$18
  Top 0.305: IC5.1 84.85,21.38 83.99,21.38 82.26,19.64 C5.2
N$19
  Top 0.305: C6.2 77.98,14.1 80.19,16.31 80.19,17.39 80.73,17.93 85.26,17.93 | 85.59,17.93 85.26,17.93 | 85.26,17.93 IC5.4
N$22
  Top 0.305: C6.1 79.5,11.3 80.19,11.99 80.19,14.69 81.81,16.31 84.86,16.31 IC5.5
N$23  (via drill 0.35)
  Top 0.305: LED4.C 49.41,50.85 49.41,50.33 49.68,50.06 | v45.63,43.85 48.06,43.85 R15.1 | 49.68,50.06 v50.49,49.25 | 49.6,49.99 49.68,50.06
  Bottom 0.305: v45.63,43.85 50.49,48.71 v50.49,49.25
N$24  (via drill 0.35)
  Top 0.305: IC2.7 102.92,36.34 v105.03,38.45
  Bottom 0.305: v105.03,38.45 105.03,51.55 D1.3
N$25
  Top 0.305: LED3.C 48.41,46.46 R14.1
N$26  (via drill 0.35)
  Top 0.305: IC6.23 22.69,51.68 v24.03,50.33 | v39.69,48.71 42.39,48.71 42.93,49.25 45.01,49.25 LED3.A
  Bottom 0.305: v24.03,50.33 29.97,50.33 31.59,48.71 v39.69,48.71
N$27  (via drill 0.35)
  Top 0.305: IC6.22 23.66,52.33 v24.57,51.41 | v40.23,50.33 44.73,50.33 LED4.A
  Bottom 0.305: v40.23,50.33 38.78,51.79 31.3,51.79 31.05,52.03 25.45,52.03 24.83,51.41 v24.57,51.41
N$28
  Top 0.305: C7.1 87.03,22.97 87.75,22.25 87.75,21.17 87.21,21.17 86.15,20.11 85.62,20.11 IC5.2
N$29
  Top 0.305: C8.2 89.47,27.55 89.91,27.11 89.91,19.23 86.48,15.81 85.62,15.81 IC5.6
N$32
  Top 0.305: R17.2 18.09,71.93 15.72,69.56 U$6.V+ | R17.2 | 18.09,76.25 R17.2 | R17.2 18.09,76.79 18.63,77.33 21.79,77.33 R16.1 | C12.1 17.9,75.71 R17.2
PI1  (via drill 0.35, 0.61)
  Top 0.3: IC4.18 32.3,19.88 32.38,19.8 | 17.8,46.01 17.8,26.63 21.55,22.88 22.3,22.88 22.55,22.63 IC4.9 | v53.05,51.13 55.3,48.88 56.8,48.88 57.55,48.13 U$5.16
  Top 0.305: IC3.18 106.78,69.27 104.63,67.12 104.63,66.44 IC3.9 104.24,64.66 v103.95,64.37 | IC4.9 23.72,22.56 25.11,21.17 25.11,20.63 26.73,19.01 30.42,19.01 31.04,19.63 32.21,19.63 32.38,19.8 32.67,20.09 | U$4.16 U$4.15 61.86,71.37 63.99,69.23 63.99,69.15 64.16,68.99 64.16,63.67 64.53,63.29 69.99,63.29 U$3.15 U$3.16 73.18,61.85 74.03,61 80.26,61 U$2.1 84.78,56.48 84.78,54.59 83.97,53.78 83.97,47.09 82.04,45.16 82.04,46.33 81.81,46.55 78.96,46.55 78.63,46.23 75.78,46.23 74.88,45.32 72.16,45.32 71.47,46.01 69.68,46.01 68.99,45.32 62.76,45.32 62.6,45.16 62.12,45.64 61.54,45.64 61.08,45.18 58.3,45.18 59.13,46.01 59.13,46.55 59.06,46.63 U$5.15 U$5.16 | v45.05,46.88 42.06,46.88 41.31,47.63 32.37,47.63 31.44,48.56 30.36,48.56 28.89,47.09 18.88,47.09 17.8,46.01
  Bottom 0.3: v45.05,46.88 50.05,51.88 53.05,51.88 v53.05,51.13
  Bottom 0.305: v103.95,64.37 90.46,64.37 U$2.1
PI2  (via drill 0.25, 0.61)
  Top 0.3: v79.3,25.88 79.8,25.88 79.8,23.13 C7.2 | 78.55,29.13 v79.3,28.38 | 78.55,29.13 76.8,29.13 C9.2 | v22.05,73.63 25.05,73.63 26.55,75.13 R16.2 | v117.8,35.13 117.05,35.88 v110.55,35.88 | 89.3,34.88 83.3,34.88 82.8,34.38 82.55,34.38 80.55,32.38 80.55,29.13 78.55,29.13 | v85.05,48.13 89.55,43.63 89.55,34.88 89.3,34.88 | 89.3,34.88 v89.55,34.63
  Top 0.305: IC1.3 42.58,11.42 C2.2 | 76.8,29.13 73.7,32.23 73.45,32.23 73.1,32.23 v70.95,30.08 | v53.05,30.43 53.3,30.68 53.69,30.68 54.94,31.93 55.25,31.93 56.62,31.93 56.5,31.81 56.55,31.76 v56.55,31.23
  Bottom 0.203: v56.55,31.23 57.83,29.95 57.83,29.66 58.57,28.93 62.76,28.93 62.91,28.77 62.91,24.58 63.65,23.85 64.69,23.85 70.93,30.08 v70.95,30.08
  Bottom 0.3: v79.3,28.38 v79.3,25.88 | v22.05,73.63 13.05,73.63 13.05,85.38 14.05,86.38 122.8,86.38 122.8,37.13 120.8,35.13 v117.8,35.13 | v110.55,35.88 101.3,35.88 101.3,29.38 100.05,28.13 89.55,28.13 v89.55,34.63 | v85.05,48.13 85.05,53.63 83.8,54.88 U$2.2 | v53.05,30.43 43.55,20.63 43.55,15.88 42.8,15.13 IC1.3
PI3  (via drill 0.35, 0.61)
  Top 0.3: 109.3,64.13 109.3,65.88 IC3.13 | v105.55,64.13 109.3,64.13 | v90.8,65.63 89.3,64.13 v87.05,64.13 | 3.05,83.81 3.05,42.13 3.8,41.38 7.55,41.38 8.8,42.63 11.55,42.63 11.55,41.38 11.05,40.88 11.05,26.13 19.05,18.13 v19.17,17.93 | 7.83,87.63 117.05,87.63 122.8,81.88 122.8,36.38 117.8,36.38 114.05,40.13 114.05,63.38 110.05,63.38 109.3,64.13
  Top 0.305: IC4.13 19.79,17.48 v19.17,17.93 | 7.83,87.63 7.64,87.44 7.36,87.44 3.73,83.81 3.05,83.81
  Bottom 0.3: v105.55,64.13 104.05,65.63 v90.8,65.63 | v87.05,64.13 81.3,58.38 81.3,57.63 U$2.3
  Bottom 0.305: v19.17,17.93 19.17,41.15 20.79,42.77 26.18,42.77 SV2.36
PI4  (via drill 0.61)
  Top 0.3: v40.8,13.88 34.55,13.88 32.3,16.13 IC4.15 | v50.55,12.38 51.05,12.88 v60.8,12.88 | v74.3,26.88 74.55,27.13 v85.55,27.13
  Bottom 0.3: v40.8,13.88 42.3,12.38 v50.55,12.38 | v60.8,12.88 72.8,24.88 74.3,24.88 v74.3,26.88 | v85.55,27.13 85.55,47.13 86.3,47.88 86.3,54.13 84.05,56.38 81.3,56.38 81.3,55.13 U$2.4
PI5  (via drill 0.35, 0.61)
  Top 0.3: IC3.12 108.05,67.88 v108.3,67.88 | v90.8,67.13 89.3,65.63 v86.8,65.63 | v13.8,25.13 15.05,25.13 19,21.18 20.05,20.13 v20.25,20.09 | v7.8,86.38 116.05,86.38 117.05,85.38 117.05,78.38 v114.05,78.38
  Top 0.305: IC4.12 22.56,19.15 21.2,19.15 v20.25,20.09 | 19,21.18 19,21.56
  Bottom 0.3: v90.8,67.13 100.3,67.13 101.05,67.88 v108.3,67.88 110.55,70.13 110.55,74.88 v114.05,78.38 | v86.8,65.63 83.3,62.13 79.3,62.13 79.3,59.88 78.8,59.38 78.8,57.63 U$2.5 | v13.8,25.13 10.8,28.13 10.8,29.88 3.05,37.63 3.05,81.63
  Bottom 0.305: v20.25,20.09 20.25,41.15 20.79,41.69 24.72,41.69 SV2.38 | 3.05,81.63 4.37,82.95 8.15,82.95 8.35,82.76 8.35,85.84 v7.8,86.38
PI8  (via drill 0.35)
  Top 0.305: JP4.1 82.73,8.21 73.71,8.21 70.87,5.37 JP6.1 | SV2.7 66.71,36.02 67.97,37.28 67.97,38.66 v69.93,40.31 | U$2.8 76.05,53.39 79.11,50.33 81.81,50.33 82.89,49.25 82.89,47.63 79.04,47.63 78.34,46.93 75.17,46.93 v74.79,46.55 | v72.63,40.61 v72.64,40.62 72.64,42.61 73.71,43.68 73.71,44.39 73.94,44.62 74.79,44.62 75.56,43.85 v75.87,43.85
  Bottom 0.305: SV2.7 66.05,31.95 65.34,31.95 65.17,31.93 56.55,31.93 55.2,31.93 54.95,31.63 54.95,30.16 56.09,29.03 56.09,15.04 56.43,14.69 56.43,12.26 57.76,10.93 59.11,10.93 59.13,10.91 59.13,10.37 58.59,9.83 58.59,8.21 | 58.59,8.21 57.77,8.21 JP2.1 | 58.59,8.21 58.59,5.67 58.24,5.32 58.24,4.44 58.86,3.82 59.74,3.82 59.81,3.89 66.75,3.89 JP6.1 | v74.79,46.55 75.33,46.55 75.87,46.01 v75.87,43.85 | v69.93,40.31 70.47,40.07 72.09,40.07 v72.63,40.61
PI10  (via drill 0.25, 0.35, 0.61)
  Top 0.203: SV2.8 66.71,36.99 65.38,35.67 65.38,34.25 v65.45,34.18
  Top 0.3: JP3.1 54.3,10.88 71.55,10.88 v71.8,11.13 | 72.55,54.13 70.3,51.88 v70.3,48.88 | 72.55,54.13 73.3,54.88 U$2.10 | 51.8,31.23 v51.8,26.38 | v79.3,31.38 79.05,31.63 | 72.55,54.13 v76.55,50.13
  Top 0.305: v71.8,11.13 72.56,10.37 v74.79,10.37 | v70.13,42.85 66.71,40.63 SV2.8 | 51.8,31.23 51.8,31.38 53.4,31.38 54.85,32.83 v57.3,32.83
  Bottom 0.203: v70.3,48.88 70.9,48.29 70.9,45.52 70.13,44.76 70.13,44.05 v70.13,42.85 | v65.45,34.18 65,33.73 65,32.53 63.15,32.53 62.85,32.83 62.5,32.83 62.44,32.89 57.36,32.89 v57.3,32.83
  Bottom 0.3: v51.8,26.38 51.8,10.63 52.8,9.63 JP3.1 | v79.3,31.38 78.8,31.88 78.8,41.15
  Bottom 0.305: v74.79,10.37 77.35,7.81 JP5.1 | 78.8,41.15 79.49,41.84 79.49,42.14 79.5,42.15 79.5,46.54 79.4,46.64 79.4,46.68 76.55,49.53 v76.55,50.13 | JP7.1 64.48,7.81 67.36,10.69 68.15,10.69 71.36,10.69 v71.8,11.13
PI22
  Top 0.305: R17.1 20.8,75.39 U$6.OUT 20.8,63.82 26.19,58.43 31.59,58.43 31.59,61.13 34.29,63.83 45.09,63.83 45.09,62.21 46.17,61.13 62.34,61.13 U$2.15
PWML
  Top 0.305: IC3.26 96.62,77.55 97.2,78.13 98.15,78.13 U$1.50
PWMR
  Top 0.305: IC3.22 101.7,77.53 102.24,78.07 108.25,78.07 U$1.54
R1  (via drill 0.35)
  Top 0.305: 100.71,76.25 100.43,75.97 IC3.23 100.43,74.37 v101.25,73.55
  Bottom 0.305: v101.25,73.55 101.25,73.61 U$1.53
R1OUT  (via drill 0.35)
  Top 0.305: v92.07,16.31 92.45,16.69 IC5.12
  Bottom 0.305: JP5.2 81.81,7.73 81.81,10.37 82.89,11.45 88.29,11.45 88.83,11.99 88.83,14.69 90.45,16.31 v92.07,16.31
R2
  Top 0.305: U$1.55 110.05,77.33 110.01,77.37 103.69,77.37 102.97,76.65 IC3.21
RS
  Bottom 0.305: U$1.22 29.88,60.68 35.41,55.15 U$2.40
RXFT  (via drill 0.35)
  Top 0.305: IC6.5 26.05,51.03 24.05,49.03 v24.05,48.23 | v11.35,48.03 v10.05,46.73 | v4.35,37.83 3.08,36.56 | 3.08,36.56 2.95,36.43 | 3.08,36.56 3.08,34.01 5.31,30.72 15.61,20.42 16.2,19.99 16.2,19.59 19.05,16.73 19.9,16.73 20.05,16.58 20.15,16.58 21.95,14.78 25.2,14.78 25.5,14.48 30.15,14.48 30.46,14.18 30.61,14.18 34,10.78 34,10.14 35.78,8.36 36.58,8.36 36.92,8.02 | 36.92,8.02 | 36.92,8.02 38.61,6.32 40.99,6.32 41.25,6.58 48.11,6.58 48.56,6.13 49.81,6.13 52.15,3.78 58.25,3.78 58.75,3.28 59.75,3.28 61.5,5.03 61.5,5.78 62.27,6.55 65.62,6.55 66.99,7.91 JP6.2
  Bottom 0.305: v24.05,48.23 23.95,48.13 11.55,48.13 11.45,48.03 v11.35,48.03 | v10.05,46.73 8.41,45.09 8.41,42.31 7.6,41.49 4.95,41.49 3.76,40.3 3.76,39.53 4.15,39.14 4.15,37.83 v4.35,37.83
RXRS  (via drill 0.35)
  Top 0.305: IC5.14 95.43,18.84 96.8,18.84 98.94,16.7 98.94,13.76 v99.09,13.61
  Bottom 0.305: v99.09,13.61 100.15,13.61 100.21,13.65 101.25,14.69 101.25,19.01 112.59,30.35 112.59,31.61 U$1.74
RXXB  (via drill 0.35)
  Top 0.305: JP2.2 55.45,9.53 54.09,8.17 50.99,8.17 v50.49,7.67 | v20.25,18.47 v16.47,22.25 | v4.69,39.91 3.07,39.91 1.89,41.69 1.89,83.81 v4.05,85.97 | v6.75,84.35 9.45,84.35 9.99,83.81 v9.99,82.19 | v25.11,17.39 26.15,17.39 26.76,16.78 28.86,16.78 30.75,14.88 32,14.88 34,12.88 37.18,12.88 v38.61,11.45
  Bottom 0.305: v50.49,7.67 49.41,7.67 47.79,9.29 40.23,9.29 40.23,11.45 v38.61,11.45 | v25.11,17.39 25.11,18.47 v20.25,18.47 | v16.47,22.25 16.37,39.81 v4.69,39.91 | 4.59,85.97 v4.05,85.97 5.13,85.97 v6.75,84.35 | v9.99,82.19 9.99,76.33 U$1.13
SERVO  (via drill 0.35)
  Top 0.305: U$7.1' U$7.1" 69.02,30.18 v71.01,28.19 | v73.17,26.03 73.17,24.95 72.63,24.41 70.54,24.41 IC7.2 68.91,22.78 68.57,22.78 68.19,22.4 68.19,20.36 C15.2 62.9,20.15 C16.2
  Bottom 0.305: v71.01,28.19 v73.17,26.03 | U$7.1 U$7.1'
SERVO1  (via drill 0.61)
  Top 0.3: v75.2,48.83 77.8,48.88 77.8,50.38 75.3,52.88 74.8,52.88 74.8,55.38 73.8,56.38 72.3,56.38 71.05,55.13 U$2.12
  Bottom 0.3: 77.05,41.69 77.05,40.38 77.3,40.13 77.3,20.88 70.05,13.63 62.55,13.63 62.55,13.13 61.05,11.63 58.05,11.63 58.05,24.13 57.55,24.63 57.55,26.13 59.05,27.63 U$7.2
  Bottom 0.305: 77.05,41.69 78.03,42.67 78.03,46.01 78.02,46.01 v75.2,48.83
SERVO2  (via drill 0.25)
  Top 0.203: 57.88,38.31 56.15,40.03 56.15,42.33 v56.45,42.63 | 68.85,48.33 v68.75,48.33 68.75,50.11 68.54,50.32 68.54,52.39 U$2.16 | 57.88,38.31 57.88,37.3 58.59,36.59 59.61,36.59 60.37,35.82 60.37,29.66 61.63,28.41 U$7.2' | 57.88,38.31 57.9,38.33 57.9,38.38
  Bottom 0.203: v56.45,42.63 63.21,42.63 63.3,42.67 68.38,42.67 69.39,43.69 69.53,43.83 69.53,45.01 69.56,45.04 69.56,45.97 | 69.56,45.97 69.56,46.18 69.56,47.92 69.45,48.03 69.05,48.03 v68.75,48.33 | 69.2,45.61 69.56,45.97
SERVO3  (via drill 0.61)
  Top 0.3: v65.55,59.63 65.8,59.38 v80.3,59.38 | v89.3,53.63 v82.05,60.88 | v88.3,39.38 84.55,35.63 83.05,35.63 82.55,35.13 76.05,35.13 74.8,33.88 v70.3,33.88
  Bottom 0.3: v65.55,59.63 64.55,58.63 64.55,56.13 63.55,55.13 U$2.18 | v80.3,59.38 81.8,60.88 v82.05,60.88 | v89.3,53.63 89.05,53.38 89.05,40.88 88.3,40.13 v88.3,39.38 | v70.3,33.88 64.3,27.88 U$7.2"
SH1  (via drill 0.35)
  Top 0.305: U$4.1 28.52,72.64 v24.03,68.15 | v11.07,68.15 7.15,68.15 U$1.11
  Bottom 0.305: v24.03,68.15 v11.07,68.15
SH2  (via drill 0.35)
  Top 0.305: U$4.2 29.95,71.37 v27.27,68.69 | U$1.15 9.24,78.44 9.25,78.43 9.25,73.75 v11.07,71.93
  Bottom 0.305: v27.27,68.69 26.19,68.69 24.93,70.8 13.05,70.8 v11.07,71.93
SH3  (via drill 0.35)
  Top 0.305: U$4.3 52.44,70.1 v52.65,70.31
  Bottom 0.305: v52.65,70.31 52.65,75.71 53.73,76.79 59.67,76.79 61.29,75.17 76.41,75.17 76.41,79.25 U$1.41
SH4  (via drill 0.35)
  Top 0.305: U$4.4 52.79,68.83 v53.19,69.23
  Bottom 0.305: v53.19,69.23 53.19,69.54 53.58,69.93 53.58,75.02 54.27,75.71 59.13,75.71 61.29,73.55 75.87,73.55 77.49,75.17 79.95,75.17 U$1.44
SH5  (via drill 0.35)
  Top 0.305: U$4.5 52.59,67.56 v52.65,67.61
  Bottom 0.305: v52.65,67.61 53.34,68.3 53.58,68.3 54.29,69.01 54.29,74.11 54.81,74.63 59.13,74.63 61.29,72.47 79.79,72.47 U$1.45
SPICLK  (via drill 0.25, 0.35, 0.61)
  Top 0.3: v37.8,8.63 40.8,8.63 41.55,7.88 48.8,7.88 52.55,11.63 70.8,11.63 v74.8,15.63
  Top 0.305: v53.19,66.53 54.62,67.96 54.62,68.09 55.36,68.83 U$4.13 | U$3.13 67.98,65.66 v66.69,64.37 | U$5.13 61.55,48.07 v61.55,52.33 | v72.55,52.63 v75.1,50.08 | v77.15,45.33 v78.74,45.33
  Bottom 0.3: v37.8,8.63 22.55,23.88 22.55,33.88 27.3,33.88 28.55,35.13 SV2.37 | v74.8,15.63 78.05,18.88 78.05,41.69 | v72.55,52.63 67.3,52.63 67.2,52.53
  Bottom 0.305: v66.69,64.37 66.69,58.35 67,58.04 67,52.73 67.2,52.53 67.23,52.49 62.29,52.49 62.12,52.33 v61.55,52.33 56.88,52.33 54.62,54.59 54.62,56.48 U$2.23 54.88,58.43 54.27,58.43 54.27,59.16 53.99,59.44 53.99,60.32 54.35,60.68 54.35,65.92 53.73,66.53 v53.19,66.53 | 78.8,42.44 78.05,41.69 | 78.74,42.5 78.8,42.44 | v77.15,45.33 77.15,45.89 75.26,47.77 74.76,47.77 74.14,48.39 74.14,49.27 74.76,49.89 74.91,49.89 v75.1,50.08 | v78.74,45.33 78.8,45.27 78.8,42.44
T1IN  (via drill 0.35)
  Top 0.305: v92.07,13.61 93.69,15.23 95.85,15.23 95.67,15.42 IC5.11
  Bottom 0.305: JP4.2 91.79,13.61 v92.07,13.61
TXFT  (via drill 0.25)
  Top 0.305: IC6.1 26,48.43 25.3,47.73 18.65,47.73 17.05,46.13 17.05,44.53 16.8,44.53 15.95,43.68 v15.95,42.78 | v7.95,40.73 7.95,40.68 8.05,40.58 7.1,40.58 6.05,39.53 6.05,36.33 4.35,34.63 4.3,34.63 v4.25,34.68 | v61.77,3.12 62.24,3.12 JP7.2
  Bottom 0.305: v15.95,42.78 12.95,42.78 12.68,43.06 | 12.68,43.06 12.65,43.08 | 12.68,43.06 10.08,43.06 10,42.98 10,42.78 v7.95,40.73 | v4.25,34.68 4.25,31.83 4.95,31.13 4.95,30.48 9.65,25.78 10,25.78 18.55,17.24 18.55,16.71 19.16,16.11 20.33,16.11 23.51,12.92 | 23.51,12.92 23.56,12.89 | 23.51,12.92 31.91,12.92 38.8,6.03 49.5,6.03 52.1,3.43 58.25,3.43 58.57,3.12 v61.77,3.12 61.8,3.08 61.2,3.08
TXRS  (via drill 0.35)
  Top 0.305: IC5.13 96.37,17.96 v98.01,16.31
  Bottom 0.305: v98.01,16.31 98.01,19.86 105.96,27.81 105.96,29.66 116.37,40.07 118.51,40.07 U$1.73
TXXB  (via drill 0.61)
  Top 0.3: v67.8,9.63 59.55,9.63 59.55,7.38 57.8,5.63 54.3,5.63 53.05,6.88 JP3.2 | v71.3,8.63 71.8,9.13 91.55,9.13 94.05,11.63 v95.55,11.63 | v111.3,30.63 114.55,33.88 v120.55,33.88
  Bottom 0.3: v67.8,9.63 71.3,9.63 v71.3,8.63 | v95.55,11.63 98.55,14.63 100.05,14.63 100.05,14.88 100.3,15.13 100.3,19.63 v111.3,30.63 | v120.55,33.88 123.55,36.88 123.55,86.63 123.05,87.13 9.05,87.13 9.05,78.13 7.05,76.13 U$1.14
WL1  (via drill 0.35)
  Top 0.305: U$4.6 49.12,66.29 v48.87,66.53
  Bottom 0.305: v48.87,66.53 48.87,79.65 U$1.30
WL2  (via drill 0.35)
  Top 0.305: v49.95,78.41 47.79,78.41 v47.25,77.87 | v47.79,64.91 50.97,64.91 U$4.7
  Bottom 0.305: U$1.31 52.52,80.98 v49.95,78.41 | v47.25,77.87 47.25,65.45 v47.79,64.91
WL3  (via drill 0.35)
  Top 0.305: v50.49,76.79 46.17,76.79 v46.17,76.25 | v48.87,63.83 50.99,63.83 U$4.8
  Bottom 0.305: U$1.32 55.22,80.98 51.03,76.79 v50.49,76.79 | v46.17,76.25 46.17,64.37 47.01,64.37 47.41,63.98 48.18,63.98 48.33,63.83 v48.87,63.83
WL4
  Top 0.305: U$1.36 65.44,78.44 SV1.1
WL5
  Top 0.305: U$1.37 67.98,78.44 SV1.2
WL6
  Top 0.305: U$1.38 70.52,78.44 SV1.3
WL7
  Top 0.305: U$1.39 73.06,78.44 SV1.4